# EAGLE design Pi (EAGLE 7.4.0)
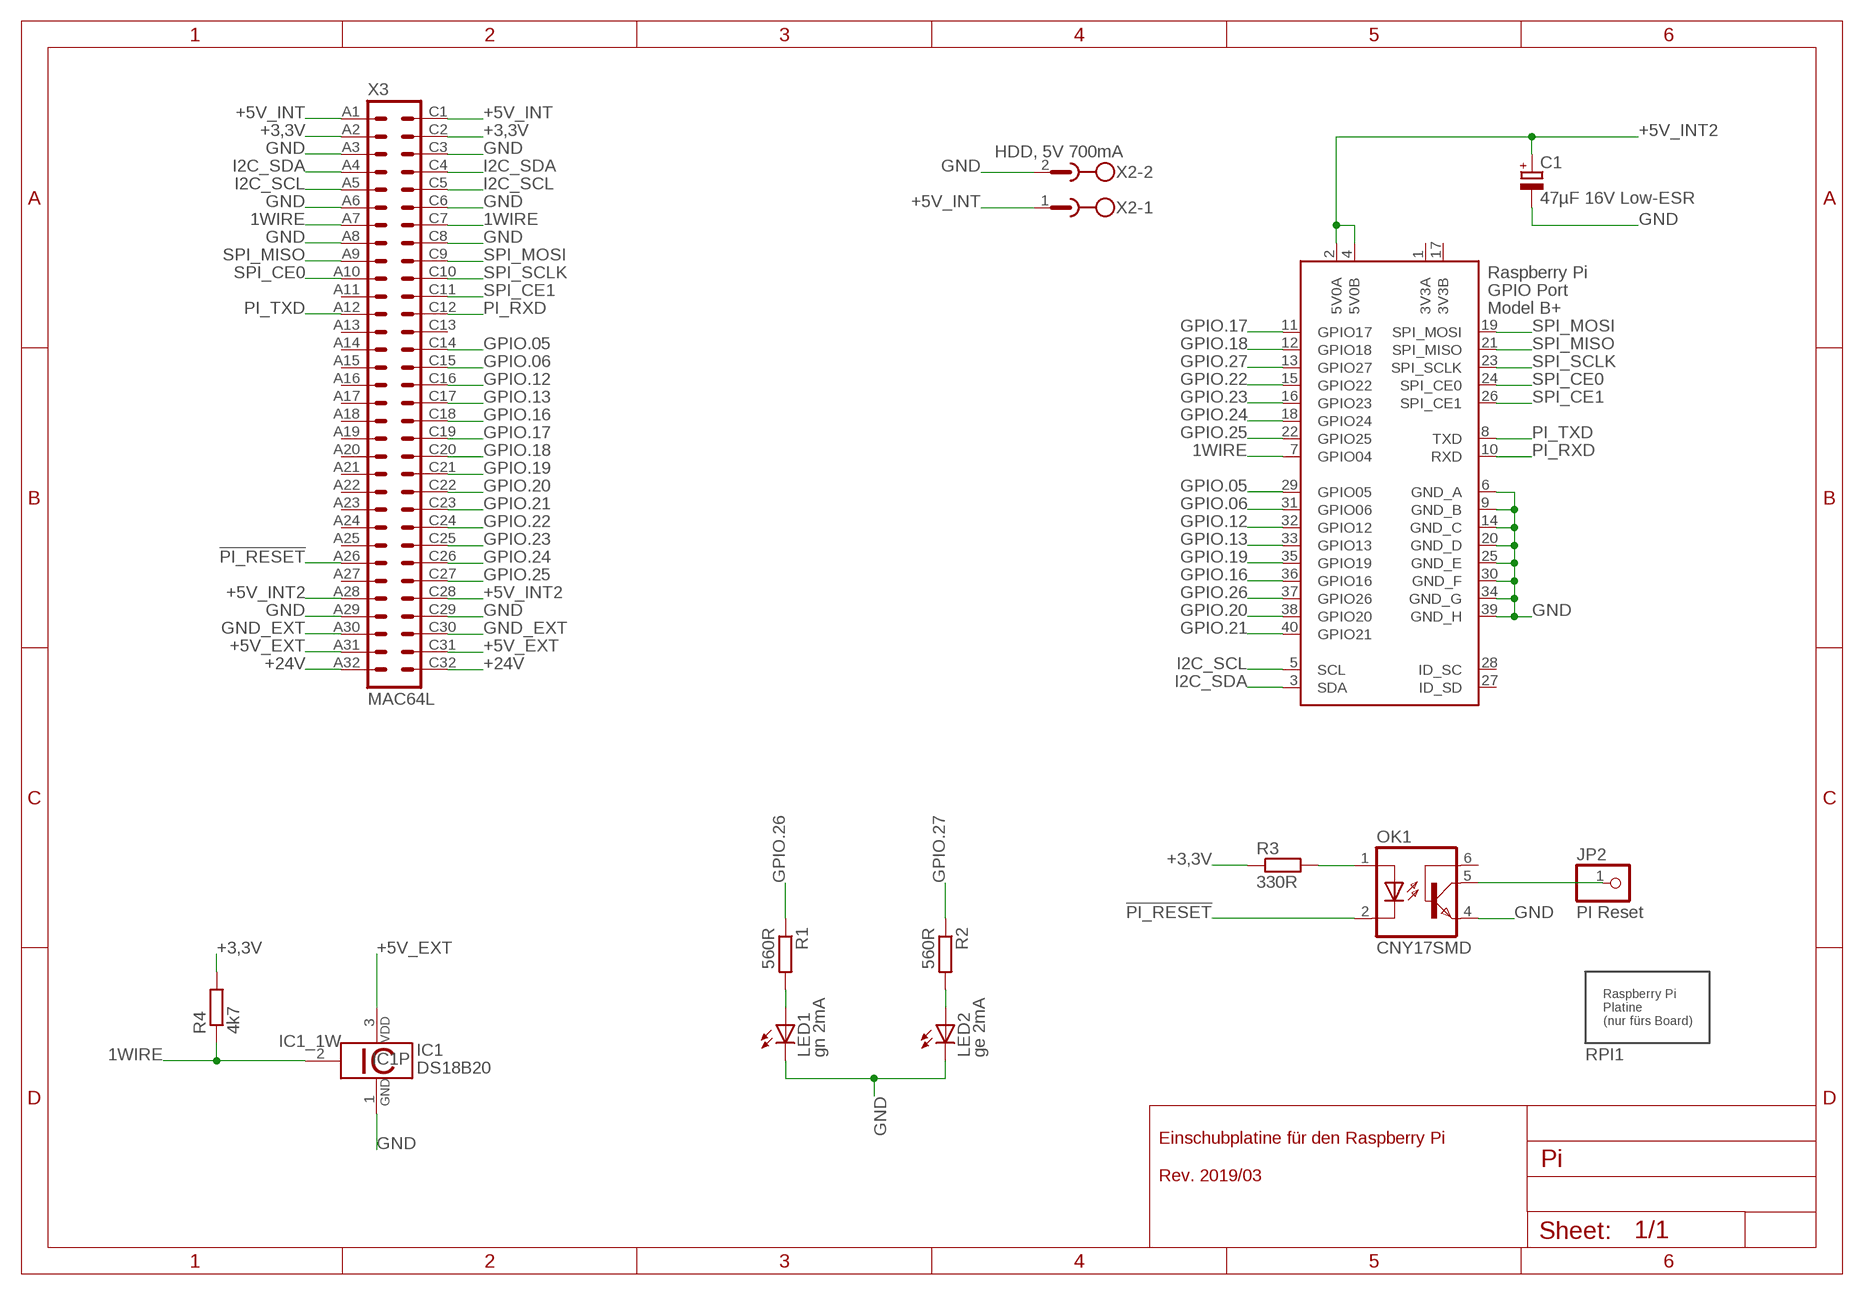
[diagram p0: schematic, sheet 1]

## Parts
C1  47µF 16V Low-ESR  CPOL-EUE2-5  [E2-5]
IC1  DS18B20  [TO92-]
JP2  PI Reset  PINHD-1X1  [1X01]
LED1  gn 2mA  LED3MM  [LED3MM]
LED2  ge 2mA  LED3MM  [LED3MM]
OK1  CNY17SMD  [DIL06_SMD]
R1  560R  R-EU_R1206  [R1206]
R2  560R  R-EU_R1206  [R1206]
R3  330R  R-EU_R1206  [R1206]
R4  4k7  R-EU_R1206  [R1206]
RPI1  RASPBERRYPI-PLATINE  [RASPBERRYPI-PLATINE]
X1  RASPI_GPIO_B+#_PIN  [RASPI_GPIO_B+_PIN]
X2  HDD, 5V 700mA  MSTBV2  [MSTBV2]
X3  MAC64L  [MAC64L]

## Nets
1WIRE: IC1.2 R4.1 X1.7(GPIO04) X3.A7 X3.C7
!PI_RESET: OK1.2(C) X3.A26
+3,3V: R3.1 R4.2 X3.A2 X3.C2
+5V_EXT: IC1.3 X3.A31 X3.C31
+5V_INT: X2.1 X3.A1 X3.C1
+5V_INT2: C1.+ X1.2(5V0A) X1.4(5V0B) X3.A28 X3.C28
+24V: X3.A32 X3.C32
GND: C1.- IC1.1 LED1.K(C) LED2.K(C) OK1.4(EMI) X1.6(GND_A) X1.9(GND_B) X1.14(GND_C) X1.20(GND_D) X1.25(GND_E) X1.30(GND_F) X1.34(GND_G) X1.39(GND_H) X2.2 X3.A3 X3.A6 X3.A8 X3.A29 X3.C3 X3.C6 X3.C8 X3.C29
GND_EXT: X3.A30 X3.C30
GPIO.05: X1.29(GPIO05) X3.C14
GPIO.06: X1.31(GPIO06) X3.C15
GPIO.12: X1.32(GPIO12) X3.C16
GPIO.13: X1.33(GPIO13) X3.C17
GPIO.16: X1.36(GPIO16) X3.C18
GPIO.17: X1.11(GPIO17) X3.C19
GPIO.18: X1.12(GPIO18) X3.C20
GPIO.19: X1.35(GPIO19) X3.C21
GPIO.20: X1.38(GPIO20) X3.C22
GPIO.21: X1.40(GPIO21) X3.C23
GPIO.22: X1.15(GPIO22) X3.C24
GPIO.23: X1.16(GPIO23) X3.C25
GPIO.24: X1.18(GPIO24) X3.C26
GPIO.25: X1.22(GPIO25) X3.C27
GPIO.26: R1.1 X1.37(GPIO26)
GPIO.27: R2.1 X1.13(GPIO27)
I2C_SCL: X1.5(SCL) X3.A5 X3.C5
I2C_SDA: X1.3(SDA) X3.A4 X3.C4
N$1: LED2.A R2.2
N$2: OK1.1(A) R3.2
N$3: JP2.1 OK1.5(COL)
N$15: LED1.A R1.2
PI_RXD: X1.10(RXD) X3.C12
PI_TXD: X1.8(TXD) X3.A12
SPI_CE0: X1.24(SPI_CE0) X3.A10
SPI_CE1: X1.26(SPI_CE1) X3.C11
SPI_MISO: X1.21(SPI_MISO) X3.A9
SPI_MOSI: X1.19(SPI_MOSI) X3.C9
SPI_SCLK: X1.23(SPI_SCLK) X3.C10
Unconnected: OK1.6(BAS) X1.27(ID_SD) X1.28(ID_SC) X3.A11 X3.A13 X3.A14 X3.A15 X3.A16 X3.A17 X3.A18 X3.A19 X3.A20 X3.A21 X3.A22 X3.A23 X3.A24 X3.A25 X3.A27 X3.C13

## Notes on the sheet
- Einschubplatine für den Raspberry Pi
  
  Rev. 2019/03

## Power pins joined to a net without a drawn wire
3V3A: X1.1(3V3A)
3V3B: X1.17(3V3B)

## Library data of the parts
C1 = rcl:CPOL-EU: POLARIZED CAPACITOR, European symbol
IC1 = 1wire:DS18B20: Programmable Resolution Digital Thermometer This chip provides a onewire thermosensor with approx. 0.5°C accuracy. A programmable over/undertemperure alarm is available. The precision can be set from 9..12 bits. Notes: Vdd must be applied for accurate measurements at low temperatures, as the parasite power circuit otherwise heats the sensor. If parasite power is used, Vdd has to be connected to GND. The DS1822 is a low-cost thermometer chip, the DS18S20 is similar to the DS18B20, but with 9 Bit precision only. Author: Jan Kandziora <jjj@gmx.de>
JP2 = pinhead:PINHD-1X1: PIN HEADER
LED1 LED2 = led:LED: LED OSRAM: - CHIPLED LG R971, LG N971, LY N971, LG Q971, LY Q971, LO R971, LY R971 LH N974, LH R974 LS Q976, LO Q976, LY Q976 LO Q996 - Hyper CHIPLED LW Q18S LB Q993, LB Q99A, LB R99A - SideLED LS A670, LO A670, LY A670, LG A670, LP A670 LB A673, LV A673, LT A673, LW A673 LH A674 LY A675 LS A676, LA A676, LO A676, LY A676, LW A676 LS A679, LY A679, LG A679 - Hyper Micro SIDELED® LS Y876, LA Y876, LO Y876, LY Y876 LT Y87S - SmartLED LW L88C, LW L88S LB L89C, LB L89S, LG L890 LS L89K, LO L89K, LY L89K LS L896, LA L896, LO L896, LY L896 - TOPLED LS T670, LO T670, LY T670, LG T670, LP T670 LSG T670, LSP T670, LSY T670, LOP T670, LYG T670 LG T671, LOG T671, LSG T671 LB T673, LV T673, LT T673, LW T673 LH T674 LS T676, LA T676, LO T676, LY T676, LB T676, LH T676, LSB T676, LW T676 LB T67C, LV T67C, LT T67C, LS T67K, LO T67K, LY T67K, LW E67C LS E67B, LA E67B, LO E67B, LY E67B, LB E67C, LV E67C, LT E67C LW T67C LS T679, LY T679, LG T679 LS T770, LO T770, LY T770, LG T770, LP T770 LB T773, LV T773, LT T773, LW T773 LH T774 LS E675, LA E675, LY E675, LS T675 LS T776, LA T776, LO T776, LY T776, LB T776 LHGB T686 LT T68C, LB T68C - Hyper Mini TOPLED® LB M676 - Mini TOPLED Santana® LG M470 LS M47K, LO M47K, LY M47K Source: http://www.osram.convergy.de LUXEON: - LUMILED® LXK2-PW12-R00, LXK2-PW12-S00, LXK2-PW14-U00, LXK2-PW14-V00 LXK2-PM12-R00, LXK2-PM12-S00, LXK2-PM14-U00 LXK2-PE12-Q00, LXK2-PE12-R00, LXK2-PE12-S00, LXK2-PE14-T00, LXK2-PE14-U00 LXK2-PB12-K00, LXK2-PB12-L00, LXK2-PB12-M00, LXK2-PB14-N00, LXK2-PB14-P00, LXK2-PB14-Q00 LXK2-PR12-L00, LXK2-PR12-M00, LXK2-PR14-Q00, LXK2-PR14-R00 LXK2-PD12-Q00, LXK2-PD12-R00, LXK2-PD12-S00 LXK2-PH12-R00, LXK2-PH12-S00 LXK2-PL12-P00, LXK2-PL12-Q00, LXK2-PL12-R00 Source: www.luxeon.com KINGBRIGHT: KA-3528ASYC Source: www.kingbright.com
OK1 = homepi:CNY17: SIEMENS OPTO COUPLER
R1-R4 = rcl:R-EU_: RESISTOR, European symbol
RPI1 = homepi:RASPBERRYPI-PLATINE: Platine des Raspberry Pi B+/2B Nur als Package für ein Board-Layout.
X1 = raspberrypi_bastelstube_v13:RASPI_GPIO_B+#: 2x20 header connector, all pins connected
X2 = con-phoenix-508:MSTBV2: PHOENIX; MPN: MSTBV 2,5/2-GF-5.08; OC_FARNELL: 1792792; OC_NEWARK: 69R9845
X3 = con-vg:MAC64L: CONNECTOR male, 64 pins, block, type C, rows AC, grid 5.08 mm

## Board
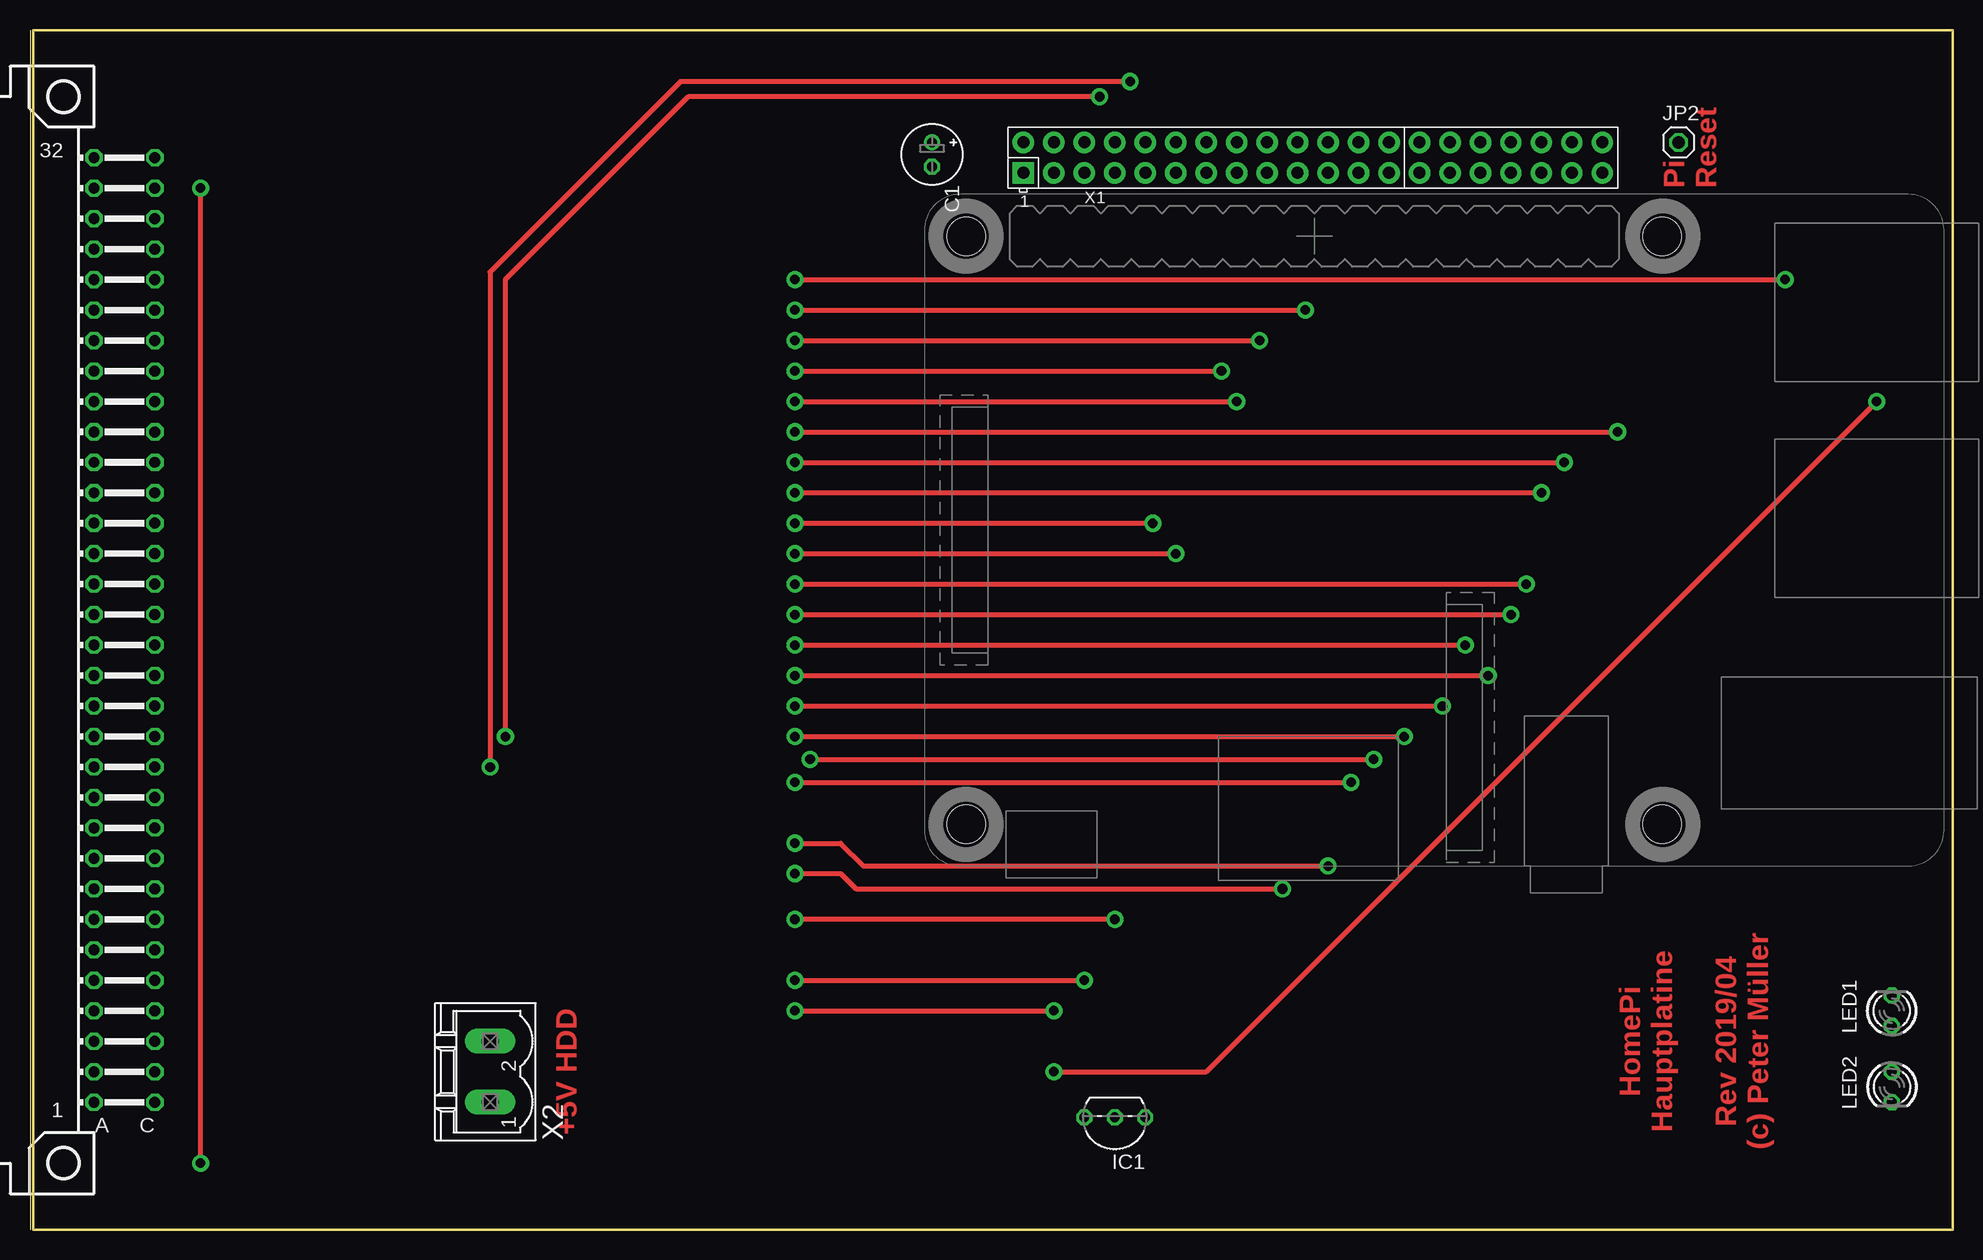
[diagram p1: board, top side]
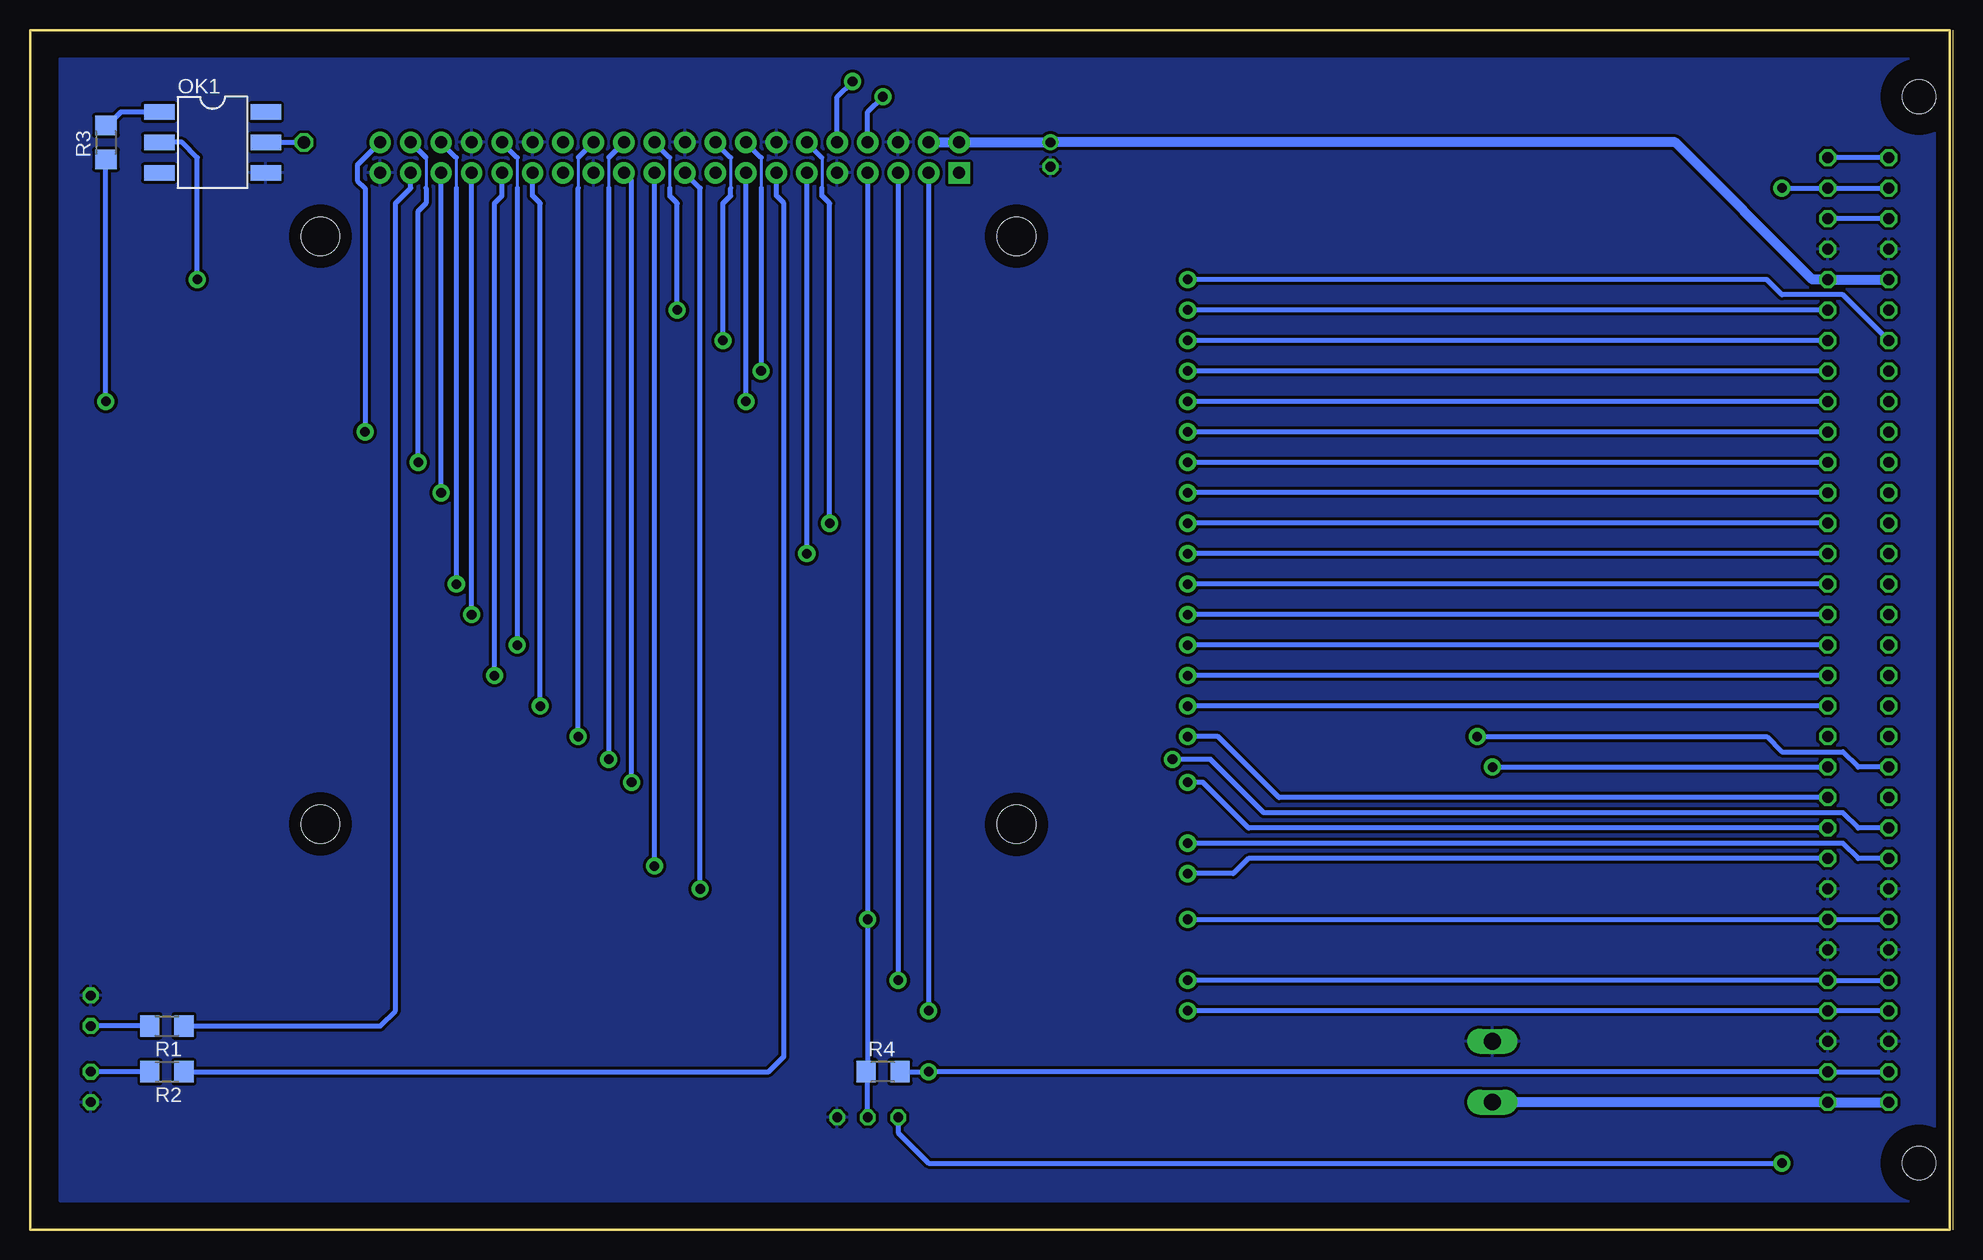
[diagram p2: board, bottom side, seen from below]

Size 160 x 100 mm. Coordinates in mm from the lower left corner, seen from the top.
Outline: 0,0 160,0 160,100 0,100 0,0
Copper layers (1*16): Top 0.035mm / dielectric 1.5mm / Bottom 0.035mm
Design rules "platinenbelichter": minimum track width 10mil, minimum drill 24mil, track to track 10mil, track to pad 10mil, pad to pad 10mil, via to via 10mil, smd to smd 10mil, copper to edge 40mil, drill to drill 8mil, minimum pad ring 10mil, minimum via ring 8mil, stop-mask expansion 10mil, vias tented up to drill 0mil, thermal gap 10mil
Holes 3.2 mm at 135.79,82.82 77.77,82.82 77.77,33.79 135.79,33.82

### Footprints (pad centres in the part's own frame; a part is rotated, then mirrored left to right if it is on the bottom)
E2-5 = drill 0.813 pad 1.27: + -1.016,0 | drill 0.813 pad 1.27 octagon: - 1.016,0
TO92- = drill 0.813 octagon: 1 -2.54,0; 2 0,0; 3 2.54,0
1X01 = drill 1.016 octagon: 1 0,0
LED3MM = drill 0.813 octagon: A -1.27,0; K 1.27,0
DIL06_SMD = smd 1.27 x 2.54: 1 -2.54,-4.445; 2 0,-4.445; 3 2.54,-4.445; 4 2.54,4.445; 5 0,4.445; 6 -2.54,4.445
R1206 = smd 1.6 x 1.803: 1 -1.422,0; 2 1.422,0
RASPI_GPIO_B+_PIN = drill 1 pad 1.778 square: 1 -24.13,-1.27 | drill 1 pad 1.778: 2 -24.13,1.27; 3 -21.59,-1.27; 4 -21.59,1.27; 5 -19.05,-1.27; 6 -19.05,1.27; 7 -16.51,-1.27; 8 -16.51,1.27; 9 -13.97,-1.27; 10 -13.97,1.27; 11 -11.43,-1.27; 12 -11.43,1.27; 13 -8.89,-1.27; 14 -8.89,1.27; 15 -6.35,-1.27; 16 -6.35,1.27; 17 -3.81,-1.27; 18 -3.81,1.27; 19 -1.27,-1.27; 20 -1.27,1.27; 21 1.27,-1.27; 22 1.27,1.27; 23 3.81,-1.27; 24 3.81,1.27; 25 6.35,-1.27; 26 6.35,1.27; 27 8.89,-1.27; 28 8.89,1.27; 29 11.43,-1.27; 30 11.43,1.27; 31 13.97,-1.27; 32 13.97,1.27; 33 16.51,-1.27; 34 16.51,1.27; 35 19.05,-1.27; 36 19.05,1.27; 37 21.59,-1.27; 38 21.59,1.27; 39 24.13,-1.27; 40 24.13,1.27
MSTBV2 = drill 1.397 long: 1 -2.54,0; 2 2.54,0
MAC64L = drill 0.914 octagon: A1 -2.54,39.37; A2 -2.54,36.83; A3 -2.54,34.29; A4 -2.54,31.75; A5 -2.54,29.21; A6 -2.54,26.67; A7 -2.54,24.13; A8 -2.54,21.59; A9 -2.54,19.05; A10 -2.54,16.51; A11 -2.54,13.97; A12 -2.54,11.43; A13 -2.54,8.89; A14 -2.54,6.35; A15 -2.54,3.81; A16 -2.54,1.27; A17 -2.54,-1.27; A18 -2.54,-3.81; A19 -2.54,-6.35; A20 -2.54,-8.89; A21 -2.54,-11.43; A22 -2.54,-13.97; A23 -2.54,-16.51; A24 -2.54,-19.05; A25 -2.54,-21.59; A26 -2.54,-24.13; A27 -2.54,-26.67; A28 -2.54,-29.21; A29 -2.54,-31.75; A30 -2.54,-34.29; A31 -2.54,-36.83; A32 -2.54,-39.37; C1 -7.62,39.37; C2 -7.62,36.83; C3 -7.62,34.29; C4 -7.62,31.75; C5 -7.62,29.21; C6 -7.62,26.67; C7 -7.62,24.13; C8 -7.62,21.59; C9 -7.62,19.05; C10 -7.62,16.51; C11 -7.62,13.97; C12 -7.62,11.43; C13 -7.62,8.89; C14 -7.62,6.35; C15 -7.62,3.81; C16 -7.62,1.27; C17 -7.62,-1.27; C18 -7.62,-3.81; C19 -7.62,-6.35; C20 -7.62,-8.89; C21 -7.62,-11.43; C22 -7.62,-13.97; C23 -7.62,-16.51; C24 -7.62,-19.05; C25 -7.62,-21.59; C26 -7.62,-24.13; C27 -7.62,-26.67; C28 -7.62,-29.21; C29 -7.62,-31.75; C30 -7.62,-34.29; C31 -7.62,-36.83; C32 -7.62,-39.37 | hole 2.794: 0,44.45; 0,-44.45

### Placement (x,y rotation side)
C1  74.93,89.63 270 top
IC1  90.17,9.36 180 top
JP2  137.16,90.64 0 top
LED1  154.94,18.25 90 top
LED2  154.94,11.9 270 top
OK1  144.78,90.64 270 bottom
R1  148.59,16.98 180 bottom
R2  148.59,13.17 180 bottom
R3  153.67,90.64 90 bottom
R4  88.9,13.17 0 bottom
RPI1  74.3,30.31 0 top
X1  106.68,89.37 0 top
X2  38.1,13.17 90 top
X3  2.54,50 180 top

### Tracks (layer width: path | path; a pad name or v marks a point on that pad's centre or on a via)
1WIRE  (via drill 0.8 pad 1.42)
  Top 0.406: v90.17,25.87 v63.5,25.87
  Bottom 0.406: X3.A7 X3.C7 v63.5,25.87 | X1.7 v90.17,25.87 90.17,13.32 R4.1 90.17,13.02 IC1.2
!PI_RESET  (via drill 0.8 pad 1.42)
  Top 0.406: v63.5,79.21 v146.05,79.21
  Bottom 0.406: X3.A26 8.89,77.94 13.97,77.94 15.24,79.21 v63.5,79.21 | v146.05,79.21 146.05,89.37 147.32,90.64 OK1.2
+3,3V  (via drill 0.8 pad 1.42)
  Top 0.406: v85.09,13.17 97.79,13.17 v153.67,69.05
  Bottom 0.406: X3.A2 X3.C2 v85.09,13.17 R4.2 | v153.67,69.05 R3.1
+5V_EXT  (via drill 0.8 pad 1.42)
  Top 0.406: v13.97,5.55 v13.97,86.83
  Bottom 0.406: X3.A31 X3.C31 v13.97,86.83 | IC1.3 87.63,8.09 85.09,5.55 v13.97,5.55
+5V_INT
  Bottom 0.813: X3.A1 X3.C1 X2.1
+5V_INT2
  Bottom 0.813: X3.A28 X3.C28 11.43,79.21 22.86,90.64 C1.+ X1.2 X1.4
+24V
  Bottom 0.406: X3.A32 X3.C32
GND
  pour Bottom: 1.27,2.38 157.48,2.38 157.48,97.62 1.27,97.62
GND_EXT
  Bottom 0.406: X3.A30 X3.C30
GPIO.05  (via drill 0.8 pad 1.42)
  Top 0.406: v63.5,43.65 v117.47,43.65
  Bottom 0.406: X3.C14 v63.5,43.65 | v117.47,43.65 117.47,85.56 118.11,86.19 X1.29
GPIO.06  (via drill 0.8 pad 1.42)
  Top 0.406: v63.5,46.19 v121.28,46.19
  Bottom 0.406: X3.C15 v63.5,46.19 | v121.28,46.19 121.28,85.56 120.65,86.19 X1.31
GPIO.12  (via drill 0.8 pad 1.42)
  Top 0.406: v63.5,48.73 v119.38,48.73
  Bottom 0.254: 119.38,89.37 119.38,86.83
  Bottom 0.406: X3.C16 v63.5,48.73 | 119.38,89.37 X1.32 | 119.38,86.83 v119.38,48.73
GPIO.13  (via drill 0.8 pad 1.42)
  Top 0.406: v63.5,51.27 v123.19,51.27
  Bottom 0.406: X3.C17 v63.5,51.27 | v123.19,51.27 X1.33
GPIO.16  (via drill 0.8 pad 1.42)
  Top 0.406: v63.5,53.81 v124.46,53.81
  Bottom 0.254: 124.46,89.37 124.46,86.83
  Bottom 0.406: X3.C18 v63.5,53.81 | 124.46,89.37 X1.36 | 124.46,86.83 v124.46,53.81
GPIO.17  (via drill 0.8 pad 1.42)
  Top 0.406: v63.5,56.35 v95.25,56.35
  Bottom 0.406: X3.C19 v63.5,56.35 | v95.25,56.35 X1.11
GPIO.18  (via drill 0.8 pad 1.42)
  Top 0.406: v63.5,58.89 v93.34,58.89
  Bottom 0.254: 93.98,89.37 93.98,86.83
  Bottom 0.406: X3.C20 v63.5,58.89 | v93.34,58.89 93.34,85.56 93.98,86.19 93.98,86.83 | 93.98,89.37 X1.12
GPIO.19  (via drill 0.8 pad 1.42)
  Top 0.406: v63.5,61.43 v125.73,61.43
  Bottom 0.406: X3.C21 v63.5,61.43 | v125.73,61.43 X1.35
GPIO.20  (via drill 0.8 pad 1.42)
  Top 0.406: v63.5,63.97 v127.64,63.97
  Bottom 0.254: 127,89.37 127,86.83
  Bottom 0.406: X3.C22 v63.5,63.97 | v127.64,63.97 127.64,84.92 127,85.56 127,86.83 | 127,89.37 X1.38
GPIO.21  (via drill 0.8 pad 1.42)
  Top 0.406: v63.5,66.51 v132.08,66.51
  Bottom 0.406: X3.C23 v63.5,66.51 | X1.40 132.72,88.73 132.72,87.47 132.08,86.83 v132.08,66.51
GPIO.22  (via drill 0.8 pad 1.42)
  Top 0.406: v63.5,69.05 v100.33,69.05
  Bottom 0.406: X3.C24 v63.5,69.05 | v100.33,69.05 X1.15
GPIO.23  (via drill 0.8 pad 1.42)
  Top 0.406: v63.5,71.59 v99.06,71.59
  Bottom 0.254: 99.06,89.37 99.06,86.83
  Bottom 0.406: X3.C25 v63.5,71.59 | 99.06,89.37 X1.16 | 99.06,86.83 v99.06,71.59
GPIO.24  (via drill 0.8 pad 1.42)
  Top 0.406: v63.5,74.13 v102.23,74.13
  Bottom 0.254: 101.6,89.37 101.6,86.83
  Bottom 0.406: X3.C26 v63.5,74.13 | v102.23,74.13 102.23,85.56 101.6,86.19 101.6,86.83 | 101.6,89.37 X1.18
GPIO.25  (via drill 0.8 pad 1.42)
  Top 0.406: v63.5,76.67 v106.05,76.67
  Bottom 0.254: 106.68,89.37 106.68,86.83
  Bottom 0.406: X3.C27 v63.5,76.67 | v106.05,76.67 106.05,85.56 106.68,86.19 106.68,86.83 | 106.68,89.37 X1.22
GPIO.26
  Bottom 0.406: R1.1 130.81,16.98 129.54,18.25 129.54,85.56 128.27,86.83 X1.37
GPIO.27
  Bottom 0.406: R2.1 98.42,13.17 97.16,14.44 97.16,85.56 97.79,86.19 X1.13
I2C_SCL  (via drill 0.8 pad 1.42)
  Top 0.406: v63.5,20.79 v87.63,20.79
  Bottom 0.406: X3.A5 X3.C5 v63.5,20.79 | X1.5 v87.63,20.79
I2C_SDA  (via drill 0.8 pad 1.42)
  Top 0.406: v63.5,18.25 v85.09,18.25
  Bottom 0.406: X3.A4 X3.C4 v63.5,18.25 | X1.3 v85.09,18.25
N$1
  Bottom 0.406: R2.2 LED2.A
N$2
  Bottom 0.406: R3.2 153.52,92.06 152.4,93.18 OK1.1
N$3
  Bottom 0.406: OK1.5 JP2.1
N$15
  Bottom 0.406: R1.2 LED1.A
PI_RXD  (via drill 0.8 pad 1.42)
  Top 0.406: v91.44,95.72 53.98,95.72 38.1,79.84 v38.1,38.57
  Bottom 0.406: X1.10 92.71,94.45 v91.44,95.72 | v38.1,38.57 X3.C12
PI_TXD  (via drill 0.8 pad 1.42)
  Top 0.406: v88.9,94.45 54.61,94.45 39.37,79.21 v39.37,41.11
  Bottom 0.406: X3.A12 7.62,38.57 8.89,39.84 13.97,39.84 15.24,41.11 v39.37,41.11 | X1.8 90.17,93.18 v88.9,94.45
SPI_CE0  (via drill 0.8 pad 1.42)
  Top 0.406: v64.77,39.2 v111.76,39.2
  Bottom 0.254: 111.76,89.37 111.76,86.83
  Bottom 0.406: X3.A10 7.62,33.49 8.89,34.76 57.15,34.76 61.59,39.2 v64.77,39.2 | 111.76,89.37 X1.24 | 111.76,86.83 v111.76,39.2
SPI_CE1  (via drill 0.8 pad 1.42)
  Top 0.406: v63.5,41.11 v114.3,41.11
  Bottom 0.254: 114.3,89.37 114.3,86.83
  Bottom 0.406: X3.C11 55.88,36.03 60.96,41.11 v63.5,41.11 | 114.3,89.37 X1.26 | v114.3,41.11 114.3,86.83
SPI_MISO  (via drill 0.8 pad 1.42)
  Top 0.406: v63.5,32.22 67.31,32.22 69.22,30.31 v107.95,30.31
  Bottom 0.406: X3.A9 7.62,30.95 8.89,32.22 v63.5,32.22 | v107.95,30.31 X1.21
SPI_MOSI  (via drill 0.8 pad 1.42)
  Top 0.406: v63.5,29.68 67.31,29.68 68.58,28.41 v104.14,28.41
  Bottom 0.406: X3.C9 58.42,30.95 59.69,29.68 v63.5,29.68 | v104.14,28.41 104.14,86.83 X1.19
SPI_SCLK  (via drill 0.8 pad 1.42)
  Top 0.406: v63.5,37.3 v109.86,37.3
  Bottom 0.406: X3.C10 58.42,33.49 62.23,37.3 v63.5,37.3 | v109.86,37.3 109.86,87.47 X1.23

### Text on the board
Top: Pi / Reset | HomePi / Hauptplatine / / Rev 2019/04 / (c) Peter Müller | +5V HDD